# EAGLE design hw_interface_board (EAGLE 8.5.0)
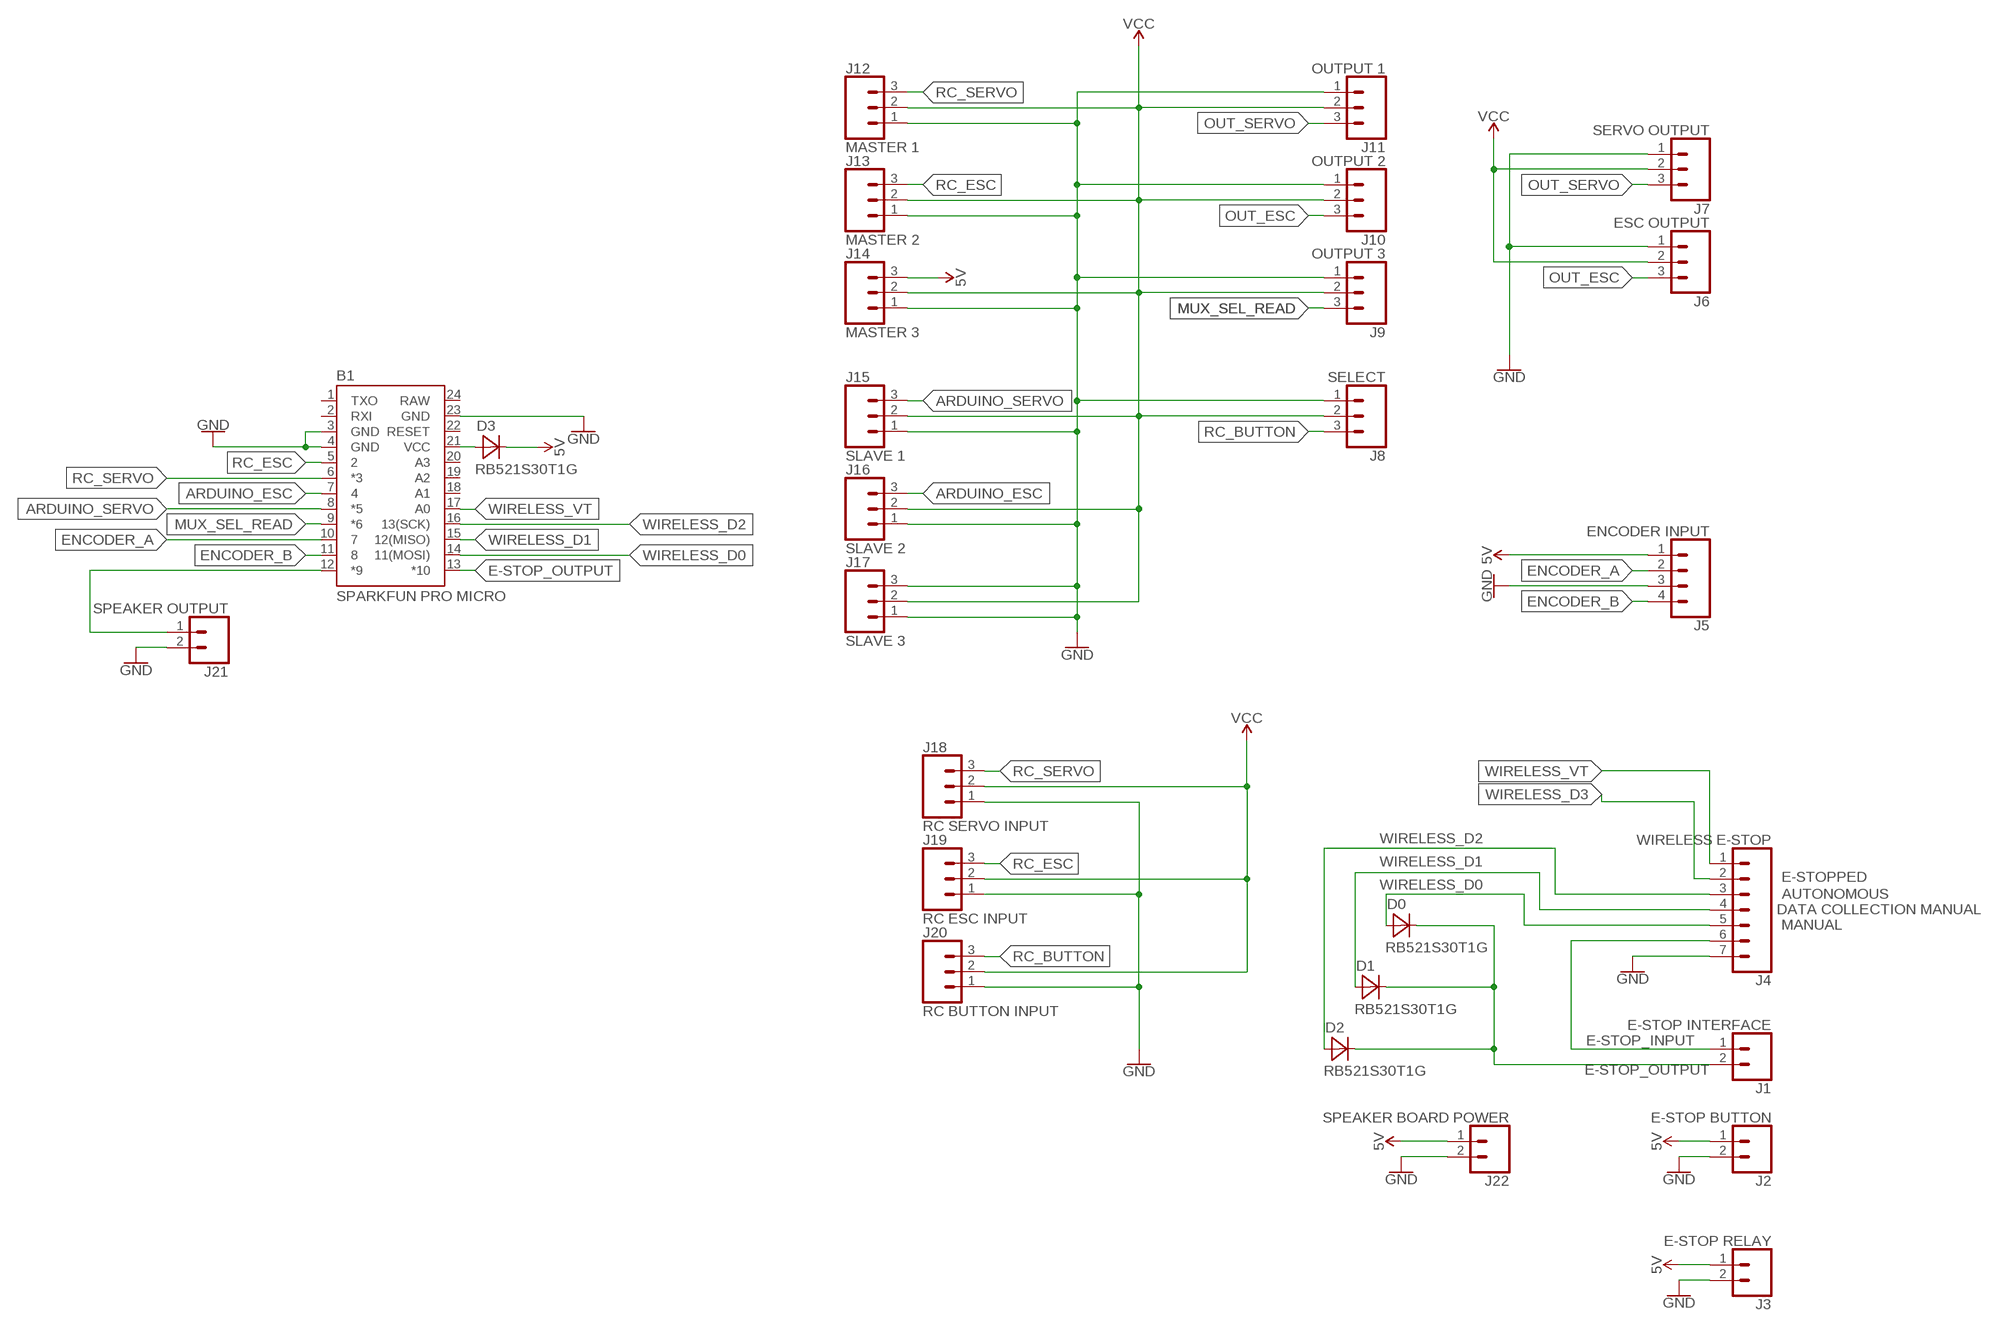
[diagram p0: schematic, sheet 1]

## Parts
B1  SPARKFUN PRO MICRO  SPARKFUN_PRO_MICRO  [SPARKFUN_PRO_MICRO]
D0  RB521S30T1G  [SOD523]
D1  RB521S30T1G  [SOD523]
D2  RB521S30T1G  [SOD523]
D3  RB521S30T1G  [SOD523]
J1  E-STOP INTERFACE  CONN_02  [1X02]
J2  E-STOP BUTTON  CONN_02  [1X02]
J3  E-STOP RELAY  CONN_02  [1X02]
J4  WIRELESS E-STOP  CONN_07  [1X07]
J5  ENCODER INPUT  CONN_04  [1X04]
J6  ESC OUTPUT  CONN_03  [1X03]
J7  SERVO OUTPUT  CONN_03  [1X03]
J8  SELECT  CONN_03  [1X03]
J9  OUTPUT 3  CONN_03  [1X03]
J10  OUTPUT 2  CONN_03  [1X03]
J11  OUTPUT 1  CONN_03  [1X03]
J12  MASTER 1  CONN_03  [1X03]
J13  MASTER 2  CONN_03  [1X03]
J14  MASTER 3  CONN_03  [1X03]
J15  SLAVE 1  CONN_03  [1X03]
J16  SLAVE 2  CONN_03  [1X03]
J17  SLAVE 3  CONN_03  [1X03]
J18  RC SERVO INPUT  CONN_03  [1X03]
J19  RC ESC INPUT  CONN_03  [1X03]
J20  RC BUTTON INPUT  CONN_03  [1X03]
J21  SPEAKER OUTPUT  CONN_02  [1X02]
J22  SPEAKER BOARD POWER  CONN_02  [1X02]

## Nets
5V: D3.C J2.1 J3.1 J5.1 J14.3 J22.1
ARDUINO_ESC: B1.7 J16.3
ARDUINO_SERVO: B1.8(*5) J15.3
E-STOP_INPUT: J1.1 J4.6
E-STOP_OUTPUT: B1.13(*10) D0.C D1.C D2.C J1.2
ENCODER_A: B1.10 J5.2
ENCODER_B: B1.11 J5.4
GND: B1.3(GND) B1.4(GND) B1.23(GND) J2.2 J3.2 J4.7 J5.3 J6.1 J7.1 J8.1 J9.1 J10.1 J11.1 J12.1 J13.1 J14.1 J15.1 J16.1 J17.1 J17.3 J18.1 J19.1 J20.1 J21.2 J22.2
MUX_SEL_READ: B1.9(*6) J9.3
N$2: B1.21(VCC) D3.A
OUT_ESC: J6.3 J10.3
OUT_SERVO: J7.3 J11.3
RC_BUTTON: J8.3 J20.3
RC_ESC: B1.5 J13.3 J19.3
RC_SERVO: B1.6(*3) J12.3 J18.3
SPEAKER_OUTPUT: B1.12(*9) J21.1
VCC: J6.2 J7.2 J8.2 J9.2 J10.2 J11.2 J12.2 J13.2 J14.2 J15.2 J16.2 J17.2 J18.2 J19.2 J20.2
WIRELESS_D0: B1.14(11(MOSI)) D0.A J4.5
WIRELESS_D1: B1.15(12(MISO)) D1.A J4.4
WIRELESS_D2: B1.16(13(SCK)) D2.A J4.3
WIRELESS_D3: J4.2
WIRELESS_VT: B1.17(A0) J4.1
Unconnected: B1.1(TXO) B1.2(RXI) B1.18(A1) B1.19(A2) B1.20(A3) B1.22(RESET)

## Notes on the sheet
- E-STOPPED
- AUTONOMOUS
- DATA COLLECTION MANUAL
- MANUAL

## Power pins joined to a net without a drawn wire
RAW: B1.24(RAW)

## Library data of the parts
B1 = SparkFun-Boards:SPARKFUN_PRO_MICRO: SparkFun Pro Micro Atmega32U4 compatible footprint. SparkFun Products: 3.3V/8MHz <https://www.sparkfun.com/products/12587> 5V/16MHz <https://www.sparkfun.com/products/12640>
D0 D1-D3 = mux-board:RB521S30T1G
J1-J3 J21 J22 = SparkFun-Connectors:CONN_02: Multi connection point. Often used as Generic Header-pin footprint for 0.1 inch spaced/style header connections On any of the 0.1 inch spaced packages, you can populate with these: Break Away Headers - Straight <https://www.sparkfun.com/products/116> (PRT-00116) Break Away Male Headers - Right Angle <https://www.sparkfun.com/products/553> (PRT-00553) Female Headers <https://www.sparkfun.com/products/115> (PRT-00115) Break Away Headers - Machine Pin <https://www.sparkfun.com/products/117> (PRT-00117) Break Away Female Headers - Swiss Machine Pin <https://www.sparkfun.com/products/743> (PRT-00743) For SCREWTERMINALS and SPRING TERMINALS visit here: Screw Terimnals on SparkFun.com <https://www.sparkfun.com/search/results?term=Screw+Terminals> (5mm/3.5mm/2.54mm spacing) This device is also useful as a general connection point to wire up your design to another part of your project. Our various solder wires solder well into these plated through hole pads. Hook-Up Wire - Assortment (Stranded, 22 AWG) <https://www.sparkfun.com/products/11375> (PRT-11375) Hook-Up Wire - Assortment (Solid Core, 22 AWG) <https://www.sparkfun.com/products/11367> (PRT-11367) View the entire wire category on our website here <https://www.sparkfun.com/categories/141> Special notes: Molex polarized connector foot print use with: PRT-08233 with associated crimp pins and housings. 2.54_SCREWTERM for use with PRT-10571. 3.5mm Screw Terminal footprints for PRT-08084 5mm Screw Terminal footprints for use with PRT-08432
J4 = SparkFun-Connectors:CONN_07: Multi connection point. Often used as Generic Header-pin footprint for 0.1 inch spaced/style header connections On any of the 0.1 inch spaced packages, you can populate with these: Break Away Headers - Straight <https://www.sparkfun.com/products/116> (PRT-00116) Break Away Male Headers - Right Angle <https://www.sparkfun.com/products/553> (PRT-00553) Female Headers <https://www.sparkfun.com/products/115> (PRT-00115) Break Away Headers - Machine Pin <https://www.sparkfun.com/products/117> (PRT-00117) Break Away Female Headers - Swiss Machine Pin <https://www.sparkfun.com/products/743> (PRT-00743) For SCREWTERMINALS and SPRING TERMINALS visit here: Screw Terimnals on SparkFun.com <https://www.sparkfun.com/search/results?term=Screw+Terminals> (5mm/3.5mm/2.54mm spacing) This device is also useful as a general connection point to wire up your design to another part of your project. Our various solder wires solder well into these plated through hole pads. Hook-Up Wire - Assortment (Stranded, 22 AWG) <https://www.sparkfun.com/products/11375> (PRT-11375) Hook-Up Wire - Assortment (Solid Core, 22 AWG) <https://www.sparkfun.com/products/11367> (PRT-11367) View the entire wire category on our website here <https://www.sparkfun.com/categories/141> Special notes: Molex polarized connector foot print use with SKU : PRT-08231 with associated crimp pins and housings. 1MM SMD Version SKU: PRT-10208 NOTES ON THE VARIANTS LOCK and LOCK_LONGPADS... This footprint was designed to help hold the alignment of a through-hole component (i.e. 6-pin header) while soldering it into place. You may notice that each hole has been shifted either up or down by 0.005 of an inch from it's more standard position (which is a perfectly straight line). This slight alteration caused the pins (the squares in the middle) to touch the edges of the holes. Because they are alternating, it causes a "brace" to hold the component in place. 0.005 has proven to be the perfect amount of "off-center" position when using our standard breakaway headers. Although looks a little odd when you look at the bare footprint, once you have a header in there, the alteration is very hard to notice. Also,if you push a header all the way into place, it is covered up entirely on the bottom side.
J5 = SparkFun-Connectors:CONN_04: Multi connection point. Often used as Generic Header-pin footprint for 0.1 inch spaced/style header connections On any of the 0.1 inch spaced packages, you can populate with these: Break Away Headers - Straight <https://www.sparkfun.com/products/116> (PRT-00116) Break Away Male Headers - Right Angle <https://www.sparkfun.com/products/553> (PRT-00553) Female Headers <https://www.sparkfun.com/products/115> (PRT-00115) Break Away Headers - Machine Pin <https://www.sparkfun.com/products/117> (PRT-00117) Break Away Female Headers - Swiss Machine Pin <https://www.sparkfun.com/products/743> (PRT-00743) For SCREWTERMINALS and SPRING TERMINALS visit here: Screw Terimnals on SparkFun.com <https://www.sparkfun.com/search/results?term=Screw+Terminals> (5mm/3.5mm/2.54mm spacing) This device is also useful as a general connection point to wire up your design to another part of your project. Our various solder wires solder well into these plated through hole pads. Hook-Up Wire - Assortment (Stranded, 22 AWG) <https://www.sparkfun.com/products/11375> (PRT-11375) Hook-Up Wire - Assortment (Solid Core, 22 AWG) <https://www.sparkfun.com/products/11367> (PRT-11367) View the entire wire category on our website here <https://www.sparkfun.com/categories/141> Special notes: Molex polarized connector foot print use with SKU : PRT-08231 with associated crimp pins and housings. 1MM SMD Version SKU: PRT-10208; PROD_ID: CONN-09696
J6-J20 = SparkFun-Connectors:CONN_03: Multi connection point. Often used as Generic Header-pin footprint for 0.1 inch spaced/style header connections On any of the 0.1 inch spaced packages, you can populate with these: Break Away Headers - Straight <https://www.sparkfun.com/products/116> (PRT-00116) Break Away Male Headers - Right Angle <https://www.sparkfun.com/products/553> (PRT-00553) Female Headers <https://www.sparkfun.com/products/115> (PRT-00115) Break Away Headers - Machine Pin <https://www.sparkfun.com/products/117> (PRT-00117) Break Away Female Headers - Swiss Machine Pin <https://www.sparkfun.com/products/743> (PRT-00743) Stackable Header - 3 Pin (Female, 0.1") <https://www.sparkfun.com/products/13875> (PRT-13875) For SCREWTERMINALS and SPRING TERMINALS visit here: Screw Terimnals on SparkFun.com <https://www.sparkfun.com/search/results?term=Screw+Terminals> (5mm/3.5mm/2.54mm spacing) This device is also useful as a general connection point to wire up your design to another part of your project. Our various solder wires solder well into these plated through hole pads. Hook-Up Wire - Assortment (Stranded, 22 AWG) <https://www.sparkfun.com/products/11375> (PRT-11375) Hook-Up Wire - Assortment (Solid Core, 22 AWG) <https://www.sparkfun.com/products/11367> (PRT-11367) View the entire wire category on our website here <https://www.sparkfun.com/categories/141> Special notes: Molex polarized connector foot print use with SKU : PRT-08232 with associated crimp pins and housings.; PROD_ID: XXX-00000; VALUE: 455-1750-1-ND

## Board
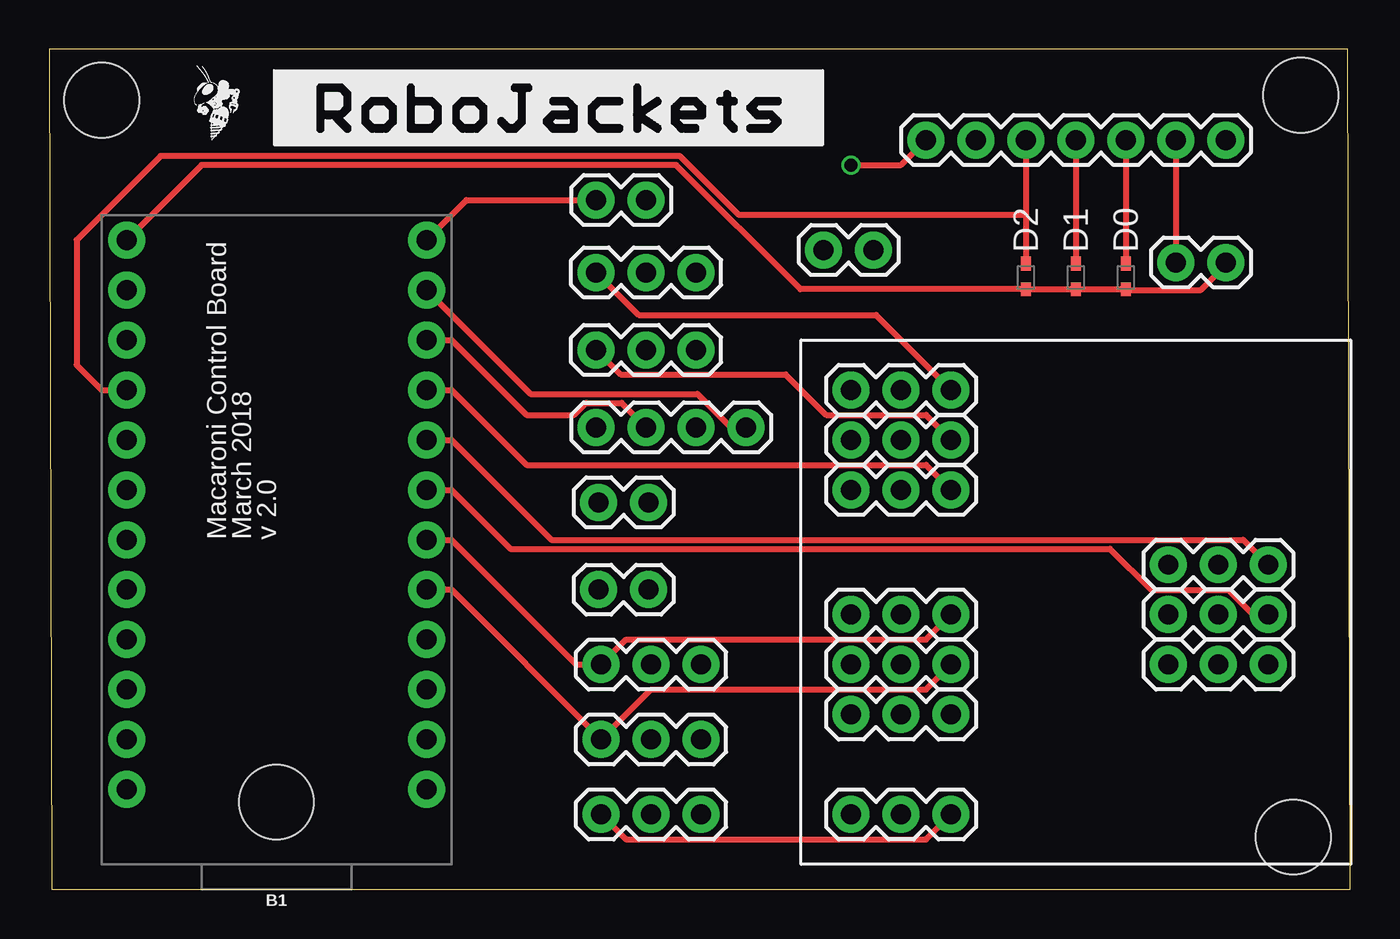
[diagram p1: board, top side]
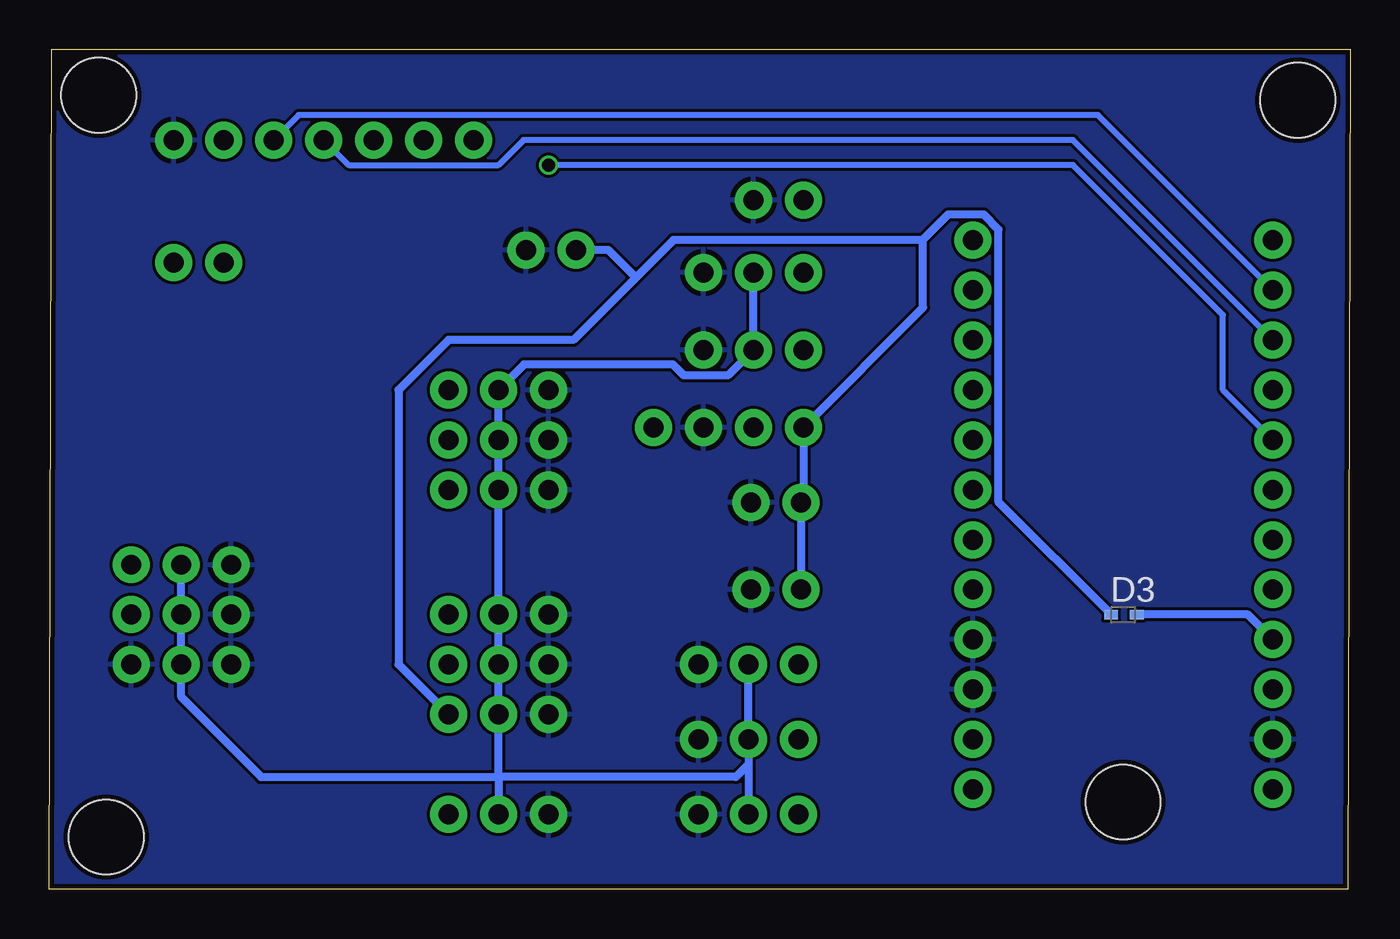
[diagram p2: board, bottom side, seen from below]

Size 66.15 x 42.72 mm. Coordinates in mm from the lower left corner, seen from the top.
Outline: 0.13,0 66.15,0 66.02,42.72 0,42.72 0.13,0
Copper layers (1*16): Top 0.035mm / dielectric 1.5mm / Bottom 0.035mm
Design rules "SeeedStudio_2layer_DRU_no_angle_20140221": minimum track width 6mil, minimum drill 12mil, track to track 6mil, track to pad 6mil, pad to pad 6mil, via to via 6mil, smd to smd 0mil, copper to edge 10mil, drill to drill 10mil, minimum pad ring 10mil, minimum via ring 6mil, stop-mask expansion 2mil, vias tented up to drill 100mil, thermal gap 10mil
Holes 3.8 mm at 2.67,40.13 11.56,4.45 63.63,40.39 63.25,2.67

### Footprints (pad centres in the part's own frame; a part is rotated, then mirrored left to right if it is on the bottom)
SPARKFUN_PRO_MICRO = drill 1.016 pad 1.88: 1 -7.62,12.7; 2 -7.62,10.16; 3 -7.62,7.62; 4 -7.62,5.08; 5 -7.62,2.54; 6 -7.62,0; 7 -7.62,-2.54; 8 -7.62,-5.08; 9 -7.62,-7.62; 10 -7.62,-10.16; 11 -7.62,-12.7; 12 -7.62,-15.24; 13 7.62,-15.24; 14 7.62,-12.7; 15 7.62,-10.16; 16 7.62,-7.62; 17 7.62,-5.08; 18 7.62,-2.54; 19 7.62,0; 20 7.62,2.54; 21 7.62,5.08; 22 7.62,7.62; 23 7.62,10.16; 24 7.62,12.7
SOD523 = smd 0.7 x 0.5: A 0.7,0; C -0.6,0
1X02 = drill 1.016 pad 1.88: 1 0,0; 2 2.54,0
1X07 = drill 1.016 pad 1.88: 1 0,0; 2 2.54,0; 3 5.08,0; 4 7.62,0; 5 10.16,0; 6 12.7,0; 7 15.24,0
1X04 = drill 1.016 pad 1.88: 1 0,0; 2 2.54,0; 3 5.08,0; 4 7.62,0
1X03 = drill 1.016 pad 1.88: 1 0,0; 2 2.54,0; 3 5.08,0

### Placement (x,y rotation side)
B1  11.56,17.78 180 top
D0  54.74,31.11 90 top
D1  52.2,31.11 90 top
D2  49.66,31.11 90 top
D3  11.56,13.97 0 bottom
J1  57.28,31.88 0 top
J2  27.94,19.68 0 top
J3  27.94,15.24 0 top
J4  44.58,38.1 0 top
J5  27.81,23.5 0 top
J6  32.89,27.43 180 top
J7  32.89,31.37 180 top
J8  40.77,3.81 0 top
J9  40.77,20.32 0 top
J10  40.77,22.86 0 top
J11  40.77,25.4 0 top
J12  40.77,13.97 0 top
J13  40.77,11.43 0 top
J14  40.77,8.89 0 top
J15  56.9,16.51 0 top
J16  56.9,13.97 0 top
J17  56.9,11.43 0 top
J18  33.15,11.43 180 top
J19  33.15,7.62 180 top
J20  33.15,3.81 180 top
J21  27.81,35.05 0 top
J22  39.37,32.51 0 top
U$1  [ROBOBUZZ_0.2X]  8.25,38.1 0 top
U$2  [ROBOJACKETS]  11.43,37.85 0 top

### Tracks (layer width: path | path; a pad name or v marks a point on that pad's centre or on a via)
5V
  Bottom 0.406: J14.3 48.39,11.43 48.39,25.4 45.85,27.94 39.5,27.94 36.32,31.11 | 36.32,31.11 34.42,33.02 21.72,33.02 | D3.C 17.88,19.7 17.88,33.56 18.64,34.32 20.45,34.32 21.72,33.05 21.72,33.02 | 21.72,33.02 21.72,29.59 J5.1 27.81,19.81 J2.1 J3.1 | 36.32,31.11 37.72,32.51 J22.1
ARDUINO_ESC
  Top 0.305: B1.7 20.45,20.32 23.44,17.32 53.92,17.32 56.03,15.21 59.95,15.21 61.2,13.97 J16.3
ARDUINO_SERVO
  Top 0.305: B1.8 20.45,22.86 25.53,17.78 60.71,17.78 J15.3
E-STOP_INPUT
  Top 0.305: J4.6 J1.1
E-STOP_OUTPUT
  Top 0.305: B1.13 7.75,36.83 31.88,36.83 38.19,30.52 D2.C D1.C D0.C 54.77,30.48 58.55,30.48 59.82,31.75 J1.2
ENCODER_A
  Top 0.305: J5.2 29.11,24.74 27.3,24.74 26.69,24.13 24.26,24.13 23.62,24.77 20.45,27.94 B1.10
ENCODER_B
  Top 0.305: J5.4 34.65,23.5 32.95,25.2 24.46,25.2 B1.11
GND
  pour Bottom: -1.14,43.18 67.44,43.18 67.44,0 -1.14,0
MUX_SEL_READ
  Top 0.305: J9.3 44.58,21.59 24.26,21.59 20.45,25.4 B1.9
N$2
  Bottom 0.406: B1.21 5.21,13.97 D3.A
OUT_ESC
  Top 0.305: J10.3 44.58,24.13 39.5,24.13 37.44,26.19 29.06,26.19 J6.3
OUT_SERVO
  Top 0.305: J11.3 42.04,29.21 29.97,29.21 J7.3
RC_BUTTON
  Top 0.305: J20.3 29.34,2.54 44.58,2.54 J8.3
RC_ESC
  Top 0.305: B1.5 20.45,15.24 J19.3 30.61,10.16 44.58,10.16 J13.3
RC_SERVO
  Top 0.305: B1.6 20.45,17.78 26.8,11.43 J18.3 29.34,12.7 44.58,12.7 J12.3
SPEAKER_OUTPUT
  Top 0.305: B1.12 21.21,35.05 J21.1
VCC
  Bottom 0.406: J18.2 J19.2 30.61,6.35 | 30.61,6.35 J20.2 | 30.61,6.35 31.24,5.71 43.31,5.71 | 43.31,5.71 J8.2 | 43.31,5.71 J14.2 J13.2 J12.2 J9.2 J10.2 J11.2 42.01,26.7 34.44,26.7 33.88,26.14 31.65,26.14 J6.2 J7.2 | 43.31,5.71 55.37,5.71 59.44,9.78 J17.2 J16.2 J15.2
WIRELESS_D0
  Top 0.305: J4.5 D0.A
  Bottom 0.305: B1.14 12.83,39.37 53.47,39.37 J4.5
WIRELESS_D1
  Top 0.305: J4.4 D1.A
  Bottom 0.305: B1.15 14.1,38.1 42.04,38.1 43.31,36.83 50.93,36.83 J4.4
WIRELESS_D2
  Top 0.305: J4.3 49.66,34.29 | 49.66,34.29 D2.A | 49.66,34.29 35.06,34.29 32.07,37.29 5.66,37.29 1.4,33.02 1.4,26.67 2.67,25.4 B1.16
WIRELESS_VT  (via drill 0.65)
  Top 0.305: v40.77,36.83 43.31,36.83 J4.1
  Bottom 0.305: B1.17 6.48,25.4 6.48,29.21 14.1,36.83 v40.77,36.83

### Text on the board
tPlace: Macaroni Control Board | March 2018 | v 2.0